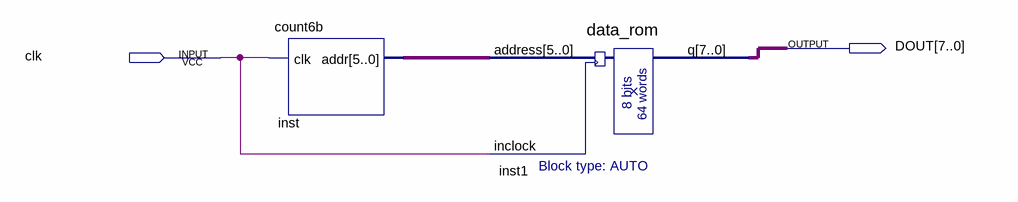
[diagram p0: schematic sheet]
// Quartus schematic sin.bdf as structural Verilog: 2 symbols, 2 pins
module sin (
  input  clk,
  output [7:0] DOUT
);

  wire [5:0] inst_addr;

  count6b inst (.clk(clk), .addr(inst_addr));
  data_rom inst1 (.address(inst_addr), .inclock(clk), .q(DOUT));
endmodule
